# EAGLE design upvol (EAGLE 9.5.1)
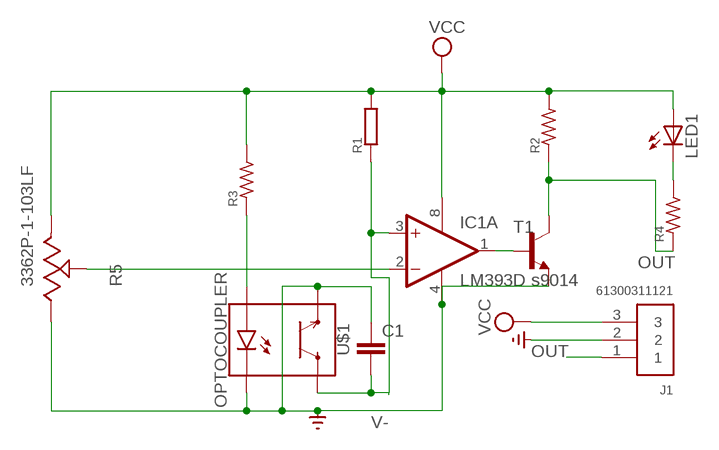
[diagram p0: schematic, sheet 1]

## Parts
C1  C2.5/2  [C2.5-2]
IC1  LM393D  [SO08]
J1  61300311121  [61300311121]
LED1  LED3MM  [LED3MM]
R1  10K  R-EU_0204/2V  [0204V]
R2  10K  RC-MASTER-SMD_R_0603MP  [RC-MASTER-SMD_R0603MP]
R3  4.7k  RC-MASTER-SMD_R_0603MP  [RC-MASTER-SMD_R0603MP]
R4  10K  RC-MASTER-SMD_R_0603MP  [RC-MASTER-SMD_R0603MP]
R5  3362P-1-103LF  [3362P-1-103LF]
T1  s9014  -NPN-SOT23-EBC  [SOT23-EBC]
U$1  OPTOCOUPLER  [OPTOCOUPLER]

## Nets
N$1: C1.2 IC1.3(A:+IN) R1.1 U$1.C
N$2: R3.1 U$1.A
N$3: LED1.K(C) R4.2
N$4: IC1.2(A:-IN) R5.2
N$5: IC1.1(A:OUT) T1.B
OUT: J1.1 R2.1 R4.1 T1.C
V+: IC1.8(P:V+) J1.3 LED1.A R1.2 R2.2 R3.2 R5.1 ; supply symbol labelled VCC
V-: C1.1 IC1.4(P:V-) J1.2 R5.3 T1.E U$1.E U$1.K ; supply symbol labelled SUPPLY_BRASTAN_GND_
Unconnected: IC1.5(B:+IN) IC1.6(B:-IN) IC1.7(B:OUT)

## Library data of the parts
C1 = capacitor-wima:C: CAPACITOR naming: grid - package width
IC1 = linear:LM393: COMPARATOR
J1 = Headers:61300311121: CONN HEADER VERT 3POS 2.54MM Manufacturer's datasheet <https://katalog.we-online.de/em/datasheet/6130xx11121.pdf>; CREATED_BY: PCBLayout.com; DIGI_KEY_PART_NUMBER: 732-5316-ND; MANUFACTURER: Wurth Electronics Inc.; MPN: 61300311121
LED1 = adafruit:LED: LED OSRAM: - CHIPLED LG R971, LG N971, LY N971, LG Q971, LY Q971, LO R971, LY R971 LH N974, LH R974 LS Q976, LO Q976, LY Q976 LO Q996 - Hyper CHIPLED LW Q18S LB Q993, LB Q99A, LB R99A - SideLED LS A670, LO A670, LY A670, LG A670, LP A670 LB A673, LV A673, LT A673, LW A673 LH A674 LY A675 LS A676, LA A676, LO A676, LY A676, LW A676 LS A679, LY A679, LG A679 - Hyper Micro SIDELED® LS Y876, LA Y876, LO Y876, LY Y876 LT Y87S - SmartLED LW L88C, LW L88S LB L89C, LB L89S, LG L890 LS L89K, LO L89K, LY L89K LS L896, LA L896, LO L896, LY L896 - TOPLED LS T670, LO T670, LY T670, LG T670, LP T670 LSG T670, LSP T670, LSY T670, LOP T670, LYG T670 LG T671, LOG T671, LSG T671 LB T673, LV T673, LT T673, LW T673 LH T674 LS T676, LA T676, LO T676, LY T676, LB T676, LH T676, LSB T676, LW T676 LB T67C, LV T67C, LT T67C, LS T67K, LO T67K, LY T67K, LW E67C LS E67B, LA E67B, LO E67B, LY E67B, LB E67C, LV E67C, LT E67C LW T67C LS T679, LY T679, LG T679 LS T770, LO T770, LY T770, LG T770, LP T770 LB T773, LV T773, LT T773, LW T773 LH T774 LS E675, LA E675, LY E675, LS T675 LS T776, LA T776, LO T776, LY T776, LB T776 LHGB T686 LT T68C, LB T68C - Hyper Mini TOPLED® LB M676 - Mini TOPLED Santana® LG M470 LS M47K, LO M47K, LY M47K Source: http://www.osram.convergy.de/
R1 = rcl:R-EU_: RESISTOR, European symbol; SPICEPREFIX: R
R2-R4 = 52101-101-REV-A_v16:RC-MASTER-SMD_R_: RESISTOR
R5 = Potentiometer_Trimmers:3362P-1-103LF: TRIMMER 10K OHM 0.5W PC PIN TOP Manufacturer's datasheet <https://www.bourns.com/docs/Product-Datasheets/3362.pdf>; CREATED_PN: PCBLayout.com; DIGIKEY_PN: 3362P-103LF-ND; MANUFACTURER: Bourns Inc.; MPN: 3362P-1-103LF
T1 = transistor:*-NPN-: NPN Transistror BF959 corrected 2008.03.06
U$1 = untitled:OPTOCOUPLER

## Board
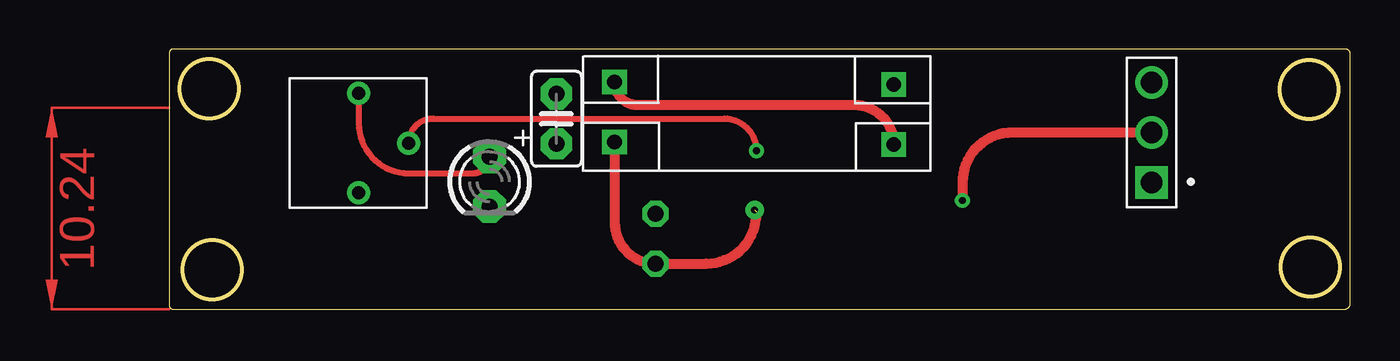
[diagram p1: board, top side]
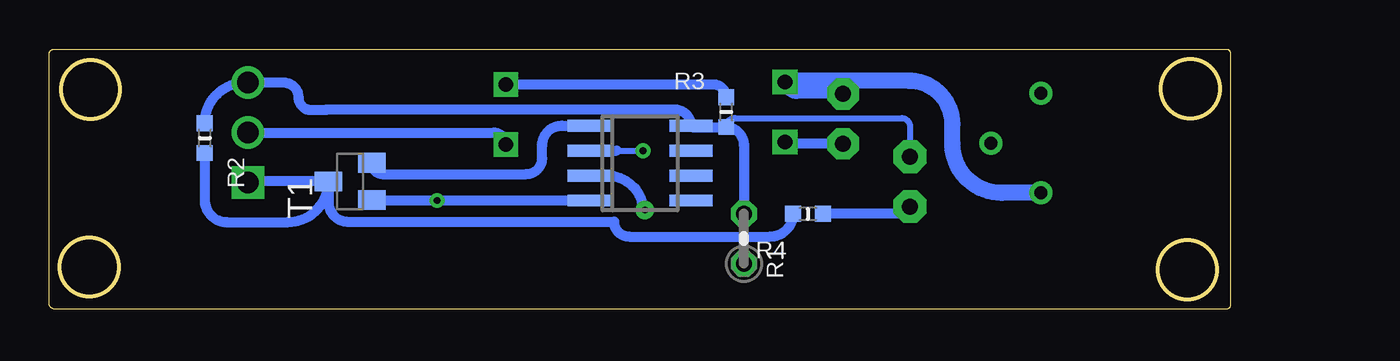
[diagram p2: board, bottom side, seen from below]

Size 60.18 x 13.24 mm. Coordinates in mm from the lower left corner, seen from the top.
Outline: 0.17,0 59.88,0 arc90 60.18,0.3 60.18,12.97 arc90 59.91,13.24 0.19,13.24 arc90 0,13.06 0,0.17 arc90 0.17,0
Copper layers (1*16): Top 0.035mm / dielectric 1.5mm / Bottom 0.035mm
Design rules "default": minimum track width 6mil, minimum drill 0.35mm, track to track 6mil, track to pad 6mil, pad to pad 6mil, via to via 6mil, smd to smd 6mil, copper to edge 40mil, drill to drill 6mil, minimum pad ring 10mil, minimum via ring 8mil, stop-mask expansion 4mil, vias tented up to drill 0mil, thermal gap 10mil
Milling: area 0.5,9.7 to 3.5,12.7; area 56.6,0.6 to 59.6,3.6; area 56.6,9.7 to 59.6,12.7; area 0.7,0.5 to 3.7,3.5

### Footprints (pad centres in the part's own frame; a part is rotated, then mirrored left to right if it is on the bottom)
C2.5-2 = drill 0.813 pad 1.6 octagon: 1 -1.27,0; 2 1.27,0
SO08 = smd 0.6 x 2.2: 1 -1.905,-2.6; 2 -0.635,-2.6; 3 0.635,-2.6; 4 1.905,-2.6; 5 1.905,2.6; 6 0.635,2.6; 7 -0.635,2.6; 8 -1.905,2.6
61300311121 = drill 1.1 square: 1 -2.54,0 | drill 1.1: 2 0,0; 3 2.54,0
LED3MM = drill 0.813 pad 1.676 octagon: A -1.27,0; K 1.27,0
0204V = drill 0.813 octagon: 1 -1.27,0; 2 1.27,0
RC-MASTER-SMD_R0603MP = smd 0.8 x 0.8: 1 -0.762,0; 2 0.762,0
3362P-1-103LF = drill 0.66: 1 -2.54,0; 2 0,2.54; 3 2.54,0
SOT23-EBC = smd 1 x 1.4: B 0.95,-1.1; C 0,1.1; E -0.95,-1.1
OPTOCOUPLER = drill 0.75 square: A -6.731,-1.524; C 7.493,1.397; E 7.493,-1.651; K -6.731,1.524

### Placement (x,y rotation side)
C1  19.72,9.69 270 top
IC1  30.07,7.43 270 bottom
J1  50.04,8.99 90 top
LED1  16.3,6.49 270 top
R1  24.78,3.59 90 bottom
R2  52.24,8.71 90 bottom
R3  25.68,10.03 270 bottom
R4  21.51,4.85 0 bottom
R5  9.65,8.46 270 top
T1  44.84,6.5 90 bottom
U$1  30.18,9.91 180 top

### Tracks (layer width: path | path; a pad name or v marks a point on that pad's centre or on a via)
N$1  (via drill 0.35 pad 0.95)  (1 unrouted)
  Top 0.508: U$1.C 22.69,4.41 arc90 R1.1 27.37,2.32 arc90 29.91,4.86 29.91,5 arc90 29.86,5.05 v29.82,5.05
  Bottom 0.508: C1.2 22.59,8.42 arc90 U$1.C | IC1.3 31.74,6.8 arc90 29.91,4.96
N$2
  Bottom 0.508: R3.1 arc-90 26.33,11.44 U$1.A
N$3
  Bottom 0.508: LED1.K arc90 16.68,4.85 R4.2
N$4  (via drill 0.35)
  Top 0.305: v29.91,8.06 arc90 28.27,9.71 13.44,9.71 arc90 R5.2
  Bottom 0.305: 31.25,8.07 v29.91,8.07 arc90 v29.91,8.06
  Bottom 0.508: IC1.2 31.25,8.07
N$5
  Bottom 0.508: T1.B arc-90 43.17,6.88 35.85,6.88 arc-90 35.06,7.67 35.06,8.34 arc90 34.05,9.34 IC1.1
OUT
  Bottom 0.508: T1.C 49.99,6.5 arc-90 J1.1 | R2.1 52.24,5.57 arc-90 51.11,4.43 48.02,4.43 arc-90 T1.C | T1.C 45.94,5.45 arc-90 44.94,4.45 31.4,4.45 arc-90 31.39,4.46 arc-90 30.62,3.69 23.44,3.69 arc-90 R4.1
V+
  Top 0.305: R5.1 9.65,9.46 arc90 12.19,6.92 15.46,6.92 arc90 LED1.A
  Top 0.508: 16.3,8.25 LED1.A
  Bottom 0.305: R3.2 arc90 25.22,9.73 16.75,9.73 arc90 16.3,9.28 LED1.A
  Bottom 0.508: 24.78,5.23 R1.2 24.78,8.37 arc-90 R3.2 27.4,9.27 arc90 IC1.8 arc-90 28.28,10.15 46.04,10.15 arc-90 46.06,10.14 46.82,10.14 arc90 47.46,10.77 arc-90 48.22,11.53 J1.3 50.18,11.53 arc-90 R2.2
V-  (via drill 0.35)
  Top 0.508: U$1.K arc90 34.9,10.4 23.85,10.4 arc-90 U$1.E | J1.2 42.95,8.99 arc90 40.41,6.45 v40.41,5.53
  Bottom 0.508: U$1.E arc-90 22.08,10.96 C1.1 arc-90 19.68,10.92 | IC1.4 v40.41,5.53 43.72,5.53 arc90 T1.E | J1.2 37.51,8.99 arc90 U$1.K
  Bottom 0.813: R5.3 11.64,5.92 arc90 14.15,8.43 14.15,9.42 arc-90 16.36,11.63 22.62,11.63 arc-90 U$1.E
(copper drawn outside any net)
  shapes: Top area x1